# EAGLE schematic logic (EAGLE 9.5.2)
IGVC Motor Control Board
REVISION: v1.2; SCH_DESC: Logic Board; TEAM: IGVC

## Sheet 1 of 5: mBed Breakout
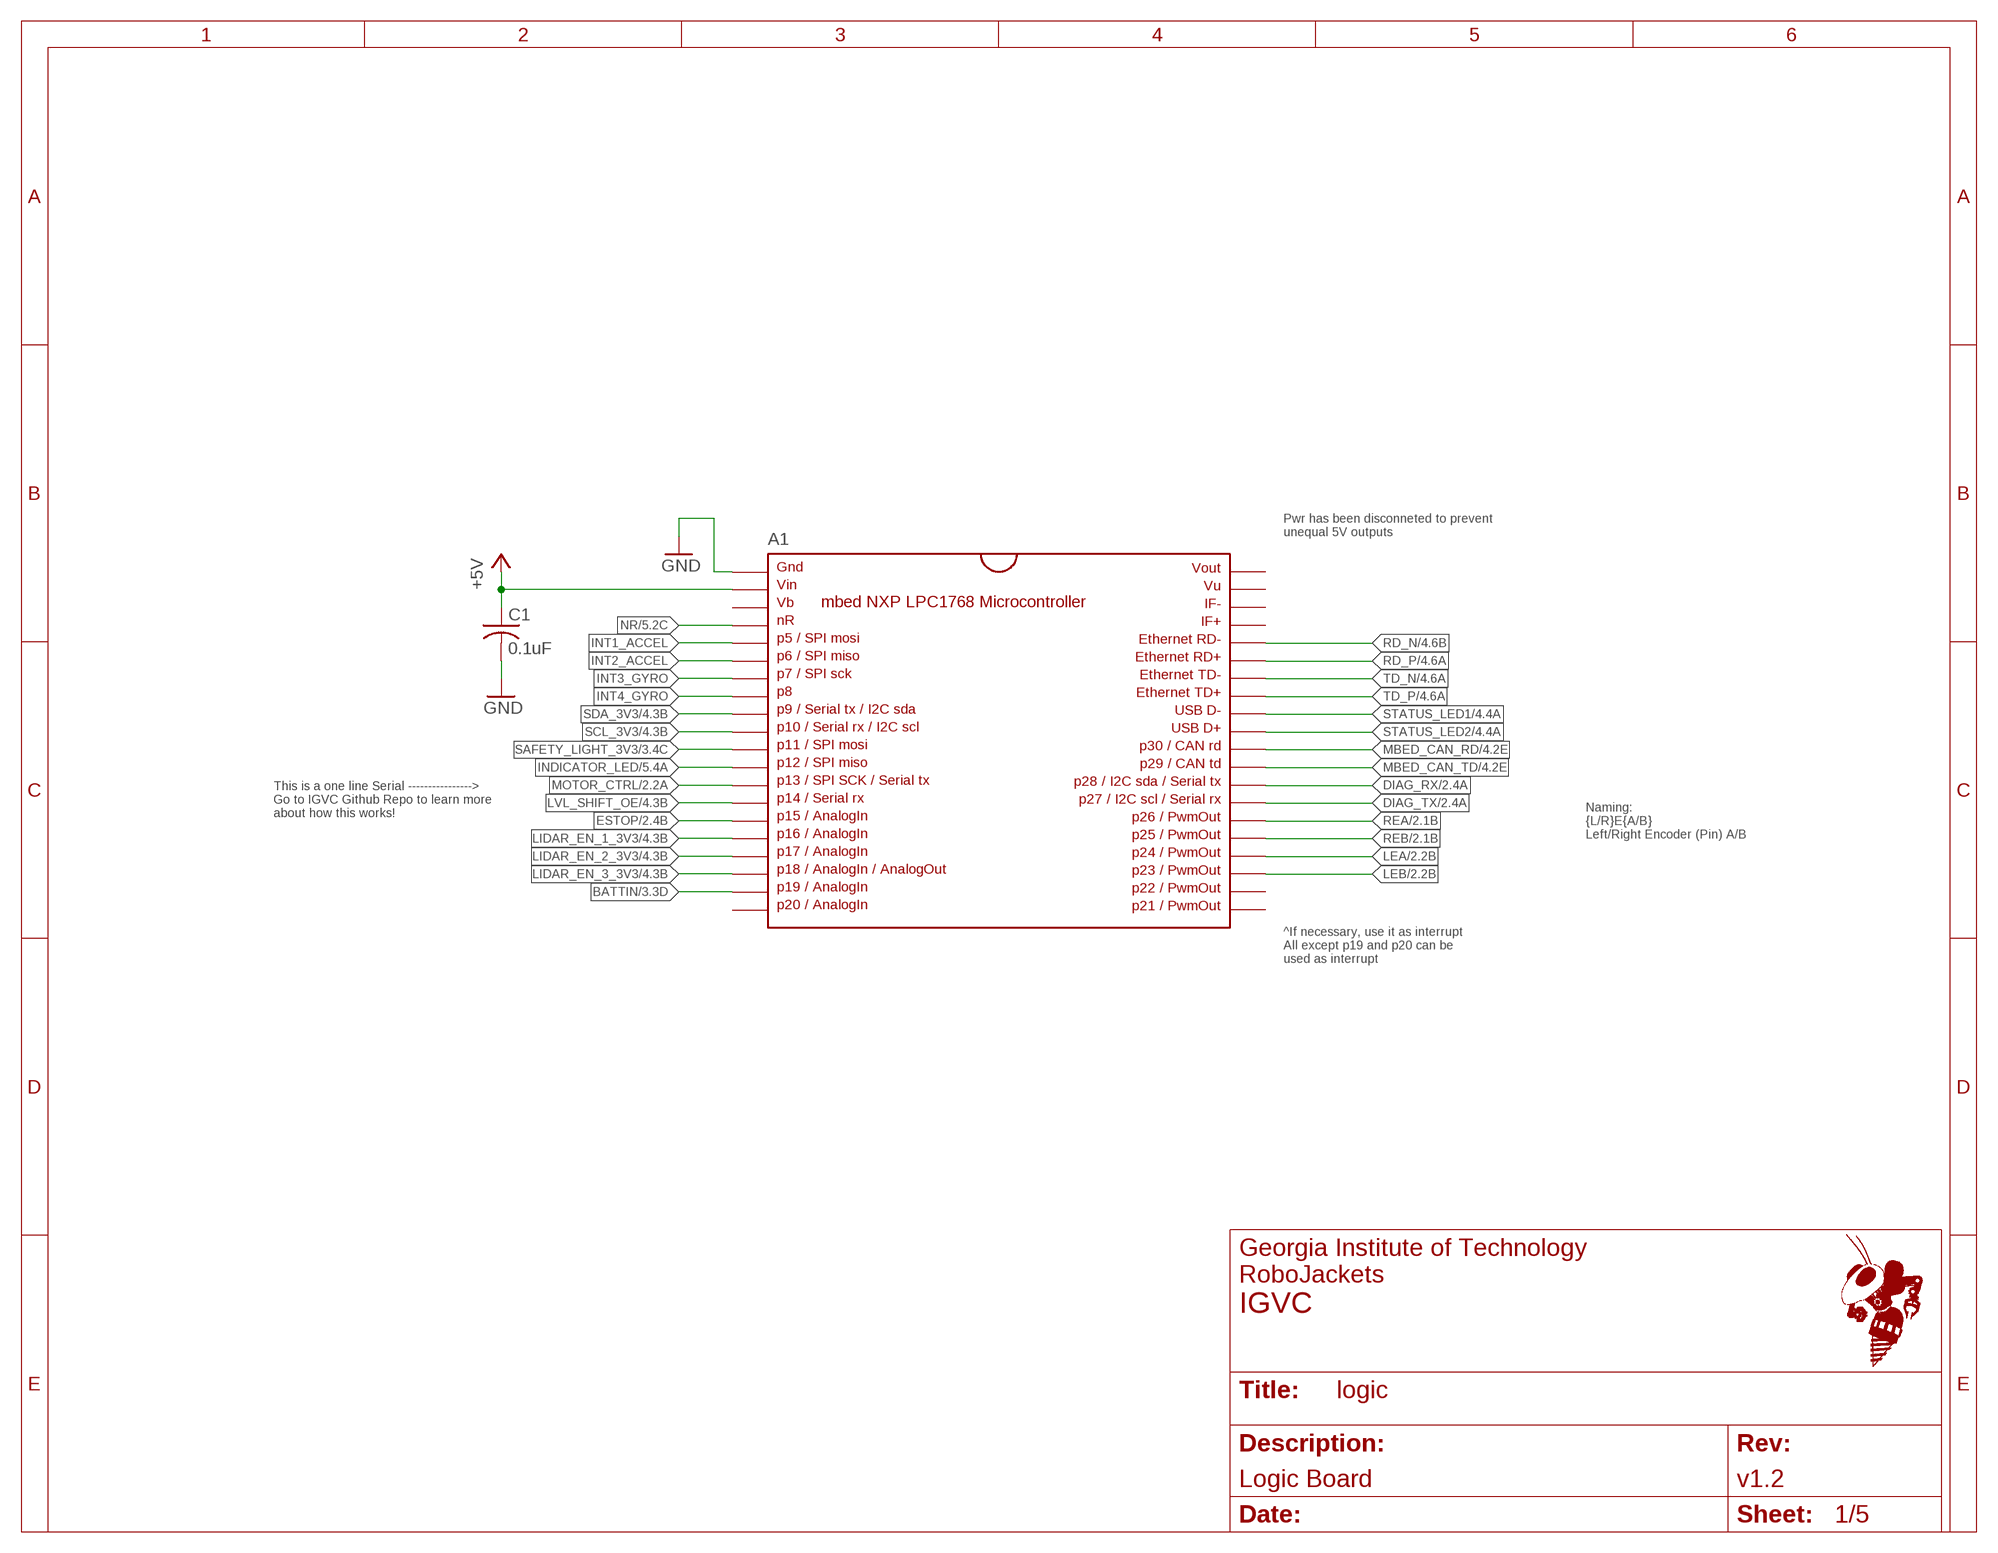
[diagram p0: schematic, sheet 1]

### Parts
A1  MBED1768  SPARKFUN-BOARDS_MBED_NXP_LPC1768  [SPARKFUN-BOARDS_DIL40_0.9]
C1  0.1uF  C-USC0603  [C0603]

### Nets
+5V: A1.2 C1.1 ; also sheet 2,3,4,5
BATTIN: A1.19 ; also sheet 3
DIAG_RX: A1.28 ; also sheet 2
DIAG_TX: A1.27 ; also sheet 2
ESTOP: A1.15 ; also sheet 2
GND: A1.1 C1.2 ; also sheet 2,3,4,5
INDICATOR_LED: A1.12 ; also sheet 5
INT1_ACCEL: A1.5
INT2_ACCEL: A1.6
INT3_GYRO: A1.7
INT4_GYRO: A1.8
LEA: A1.24 ; also sheet 2
LEB: A1.23 ; also sheet 2
LIDAR_EN_1_3V3: A1.16 ; also sheet 4
LIDAR_EN_2_3V3: A1.17 ; also sheet 4
LIDAR_EN_3_3V3: A1.18 ; also sheet 4
LVL_SHIFT_OE: A1.14 ; also sheet 4
MBED_CAN_RD: A1.30 ; also sheet 4
MBED_CAN_TD: A1.29 ; also sheet 4
MOTOR_CTRL: A1.13 ; also sheet 2
NR: A1.4 ; also sheet 5
RD_N: A1.36 ; also sheet 4
RD_P: A1.35 ; also sheet 4
REA: A1.26 ; also sheet 2
REB: A1.25 ; also sheet 2
SAFETY_LIGHT_3V3: A1.11 ; also sheet 3
SCL_3V3: A1.10 ; also sheet 4
SDA_3V3: A1.9 ; also sheet 4
STATUS_LED1: A1.32 ; also sheet 4
STATUS_LED2: A1.31 ; also sheet 4
TD_N: A1.34 ; also sheet 4
TD_P: A1.33 ; also sheet 4
Unconnected: A1.3 A1.20 A1.21 A1.22 A1.37 A1.38 A1.39 A1.40

### Notes on the sheet
- Pwr has been disconneted to prevent
  unequal 5V outputs
- This is a one line Serial ---------------->
  Go to IGVC Github Repo to learn more
  about how this works!
- Naming:
  {L/R}E{A/B}
  Left/Right Encoder (Pin) A/B
- ^If necessary, use it as interrupt
  All except p19 and p20 can be
  used as interrupt

## Sheet 2 of 5: Motor Control
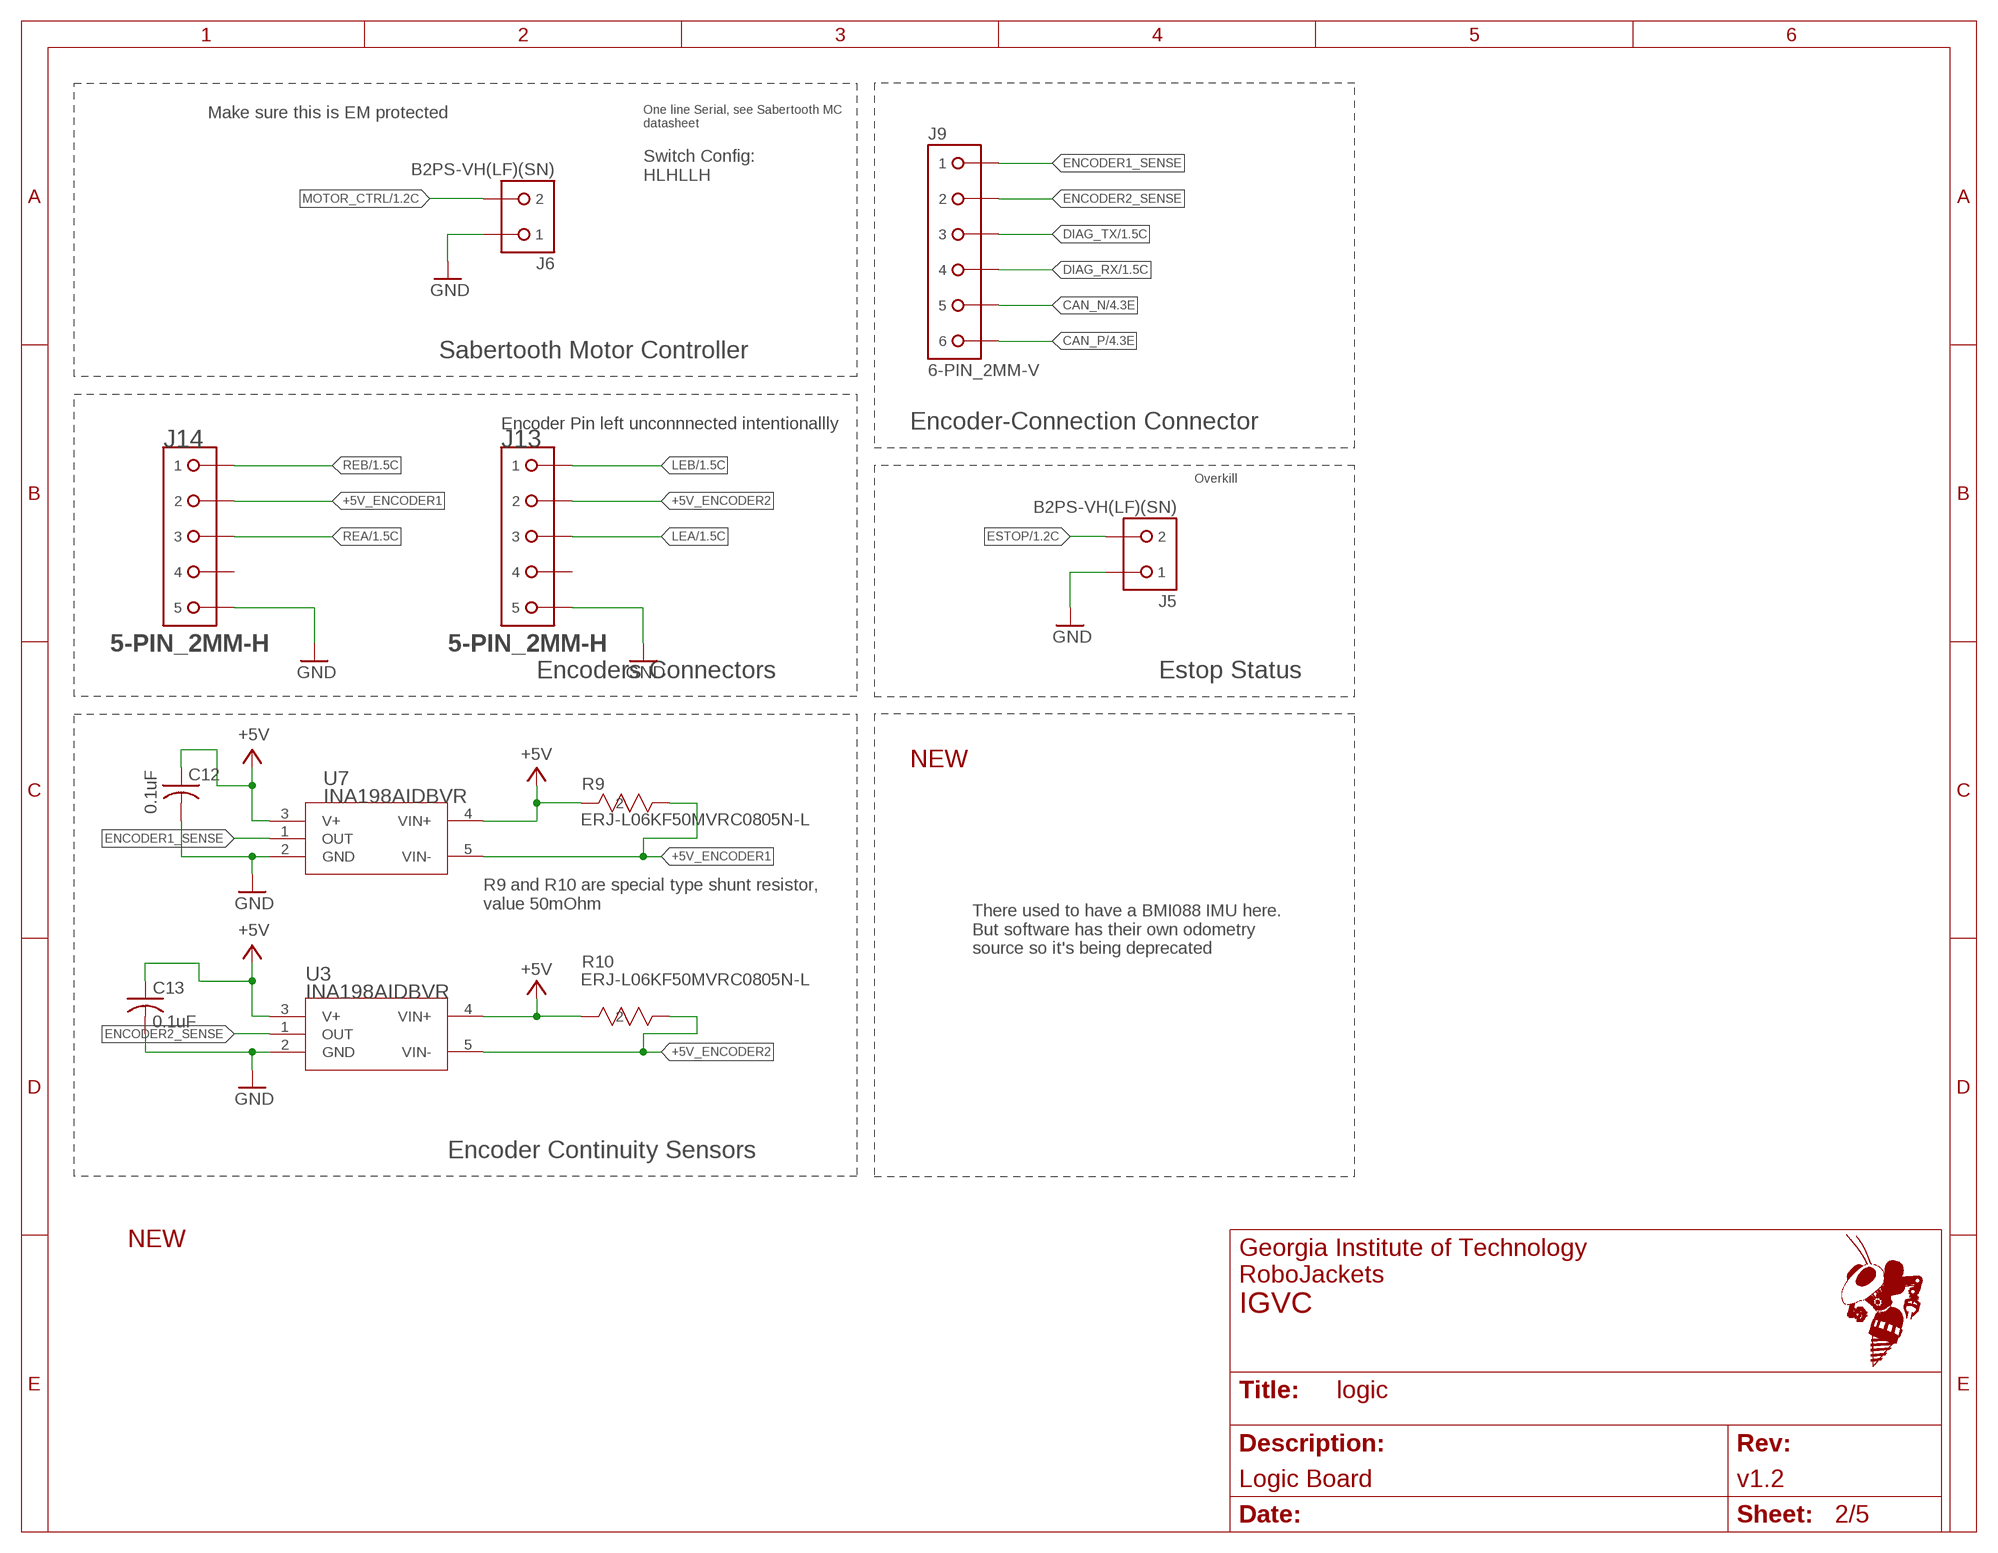
[diagram p1: schematic, sheet 2]

### Parts
C12  0.1uF  C-USC0603  [C0603]
C13  0.1uF  C-USC0603  [C0603]
J5  B2PS-VH(LF)(SN)  [B2PS-CENTERED]
J6  B2PS-VH(LF)(SN)  [B2PS-CENTERED]
J9  6-PIN_2MM-V  [2MM-6-V]
J13  5-PIN_2MM-H  [2MM-5-H]
J14  5-PIN_2MM-H  [2MM-5-H]
R9  ERJ-L06KF50MVRC0805N-L  [RC0805N-L]
R10  ERJ-L06KF50MVRC0805N-L  [RC0805N-L]
U3  INA198AIDBVR  [DBV5]
U7  INA198AIDBVR  [DBV5]

### Nets
+5V: C12.1 C13.1 R9.2 R10.2 U3.3(V+) U3.4(VIN+) U7.3(V+) U7.4(VIN+) ; also sheet 1,3,4,5
+5V_ENCODER1: J14.2 R9.1 U7.5(VIN-)
+5V_ENCODER2: J13.2 R10.1 U3.5(VIN-)
CAN_N: J9.5 ; also sheet 4
CAN_P: J9.6 ; also sheet 4
DIAG_RX: J9.4 ; also sheet 1
DIAG_TX: J9.3 ; also sheet 1
ENCODER1_SENSE: J9.1 U7.1(OUT)
ENCODER2_SENSE: J9.2 U3.1(OUT)
ESTOP: J5.2 ; also sheet 1
GND: C12.2 C13.2 J5.1 J6.1 J13.5 J14.5 U3.2(GND) U7.2(GND) ; also sheet 1,3,4,5
LEA: J13.3 ; also sheet 1
LEB: J13.1 ; also sheet 1
MOTOR_CTRL: J6.2 ; also sheet 1
REA: J14.3 ; also sheet 1
REB: J14.1 ; also sheet 1
Unconnected: J13.4 J14.4

### Notes on the sheet
- Make sure this is EM protected
- One line Serial, see Sabertooth MC 
  datasheet
- Switch Config:
  HLHLLH
- Sabertooth Motor Controller
- Encoder Pin left unconnnected intentionallly | Encoder-Connection Connector
- Overkill
- Encoders Connectors | Estop Status
- NEW
- R9 and R10 are special type shunt resistor,
  value 50mOhm
- There used to have a BMI088 IMU here. 
  But software has their own odometry
  source so it's being deprecated
- Encoder Continuity Sensors
- NEW

## Sheet 3 of 5: Light Control
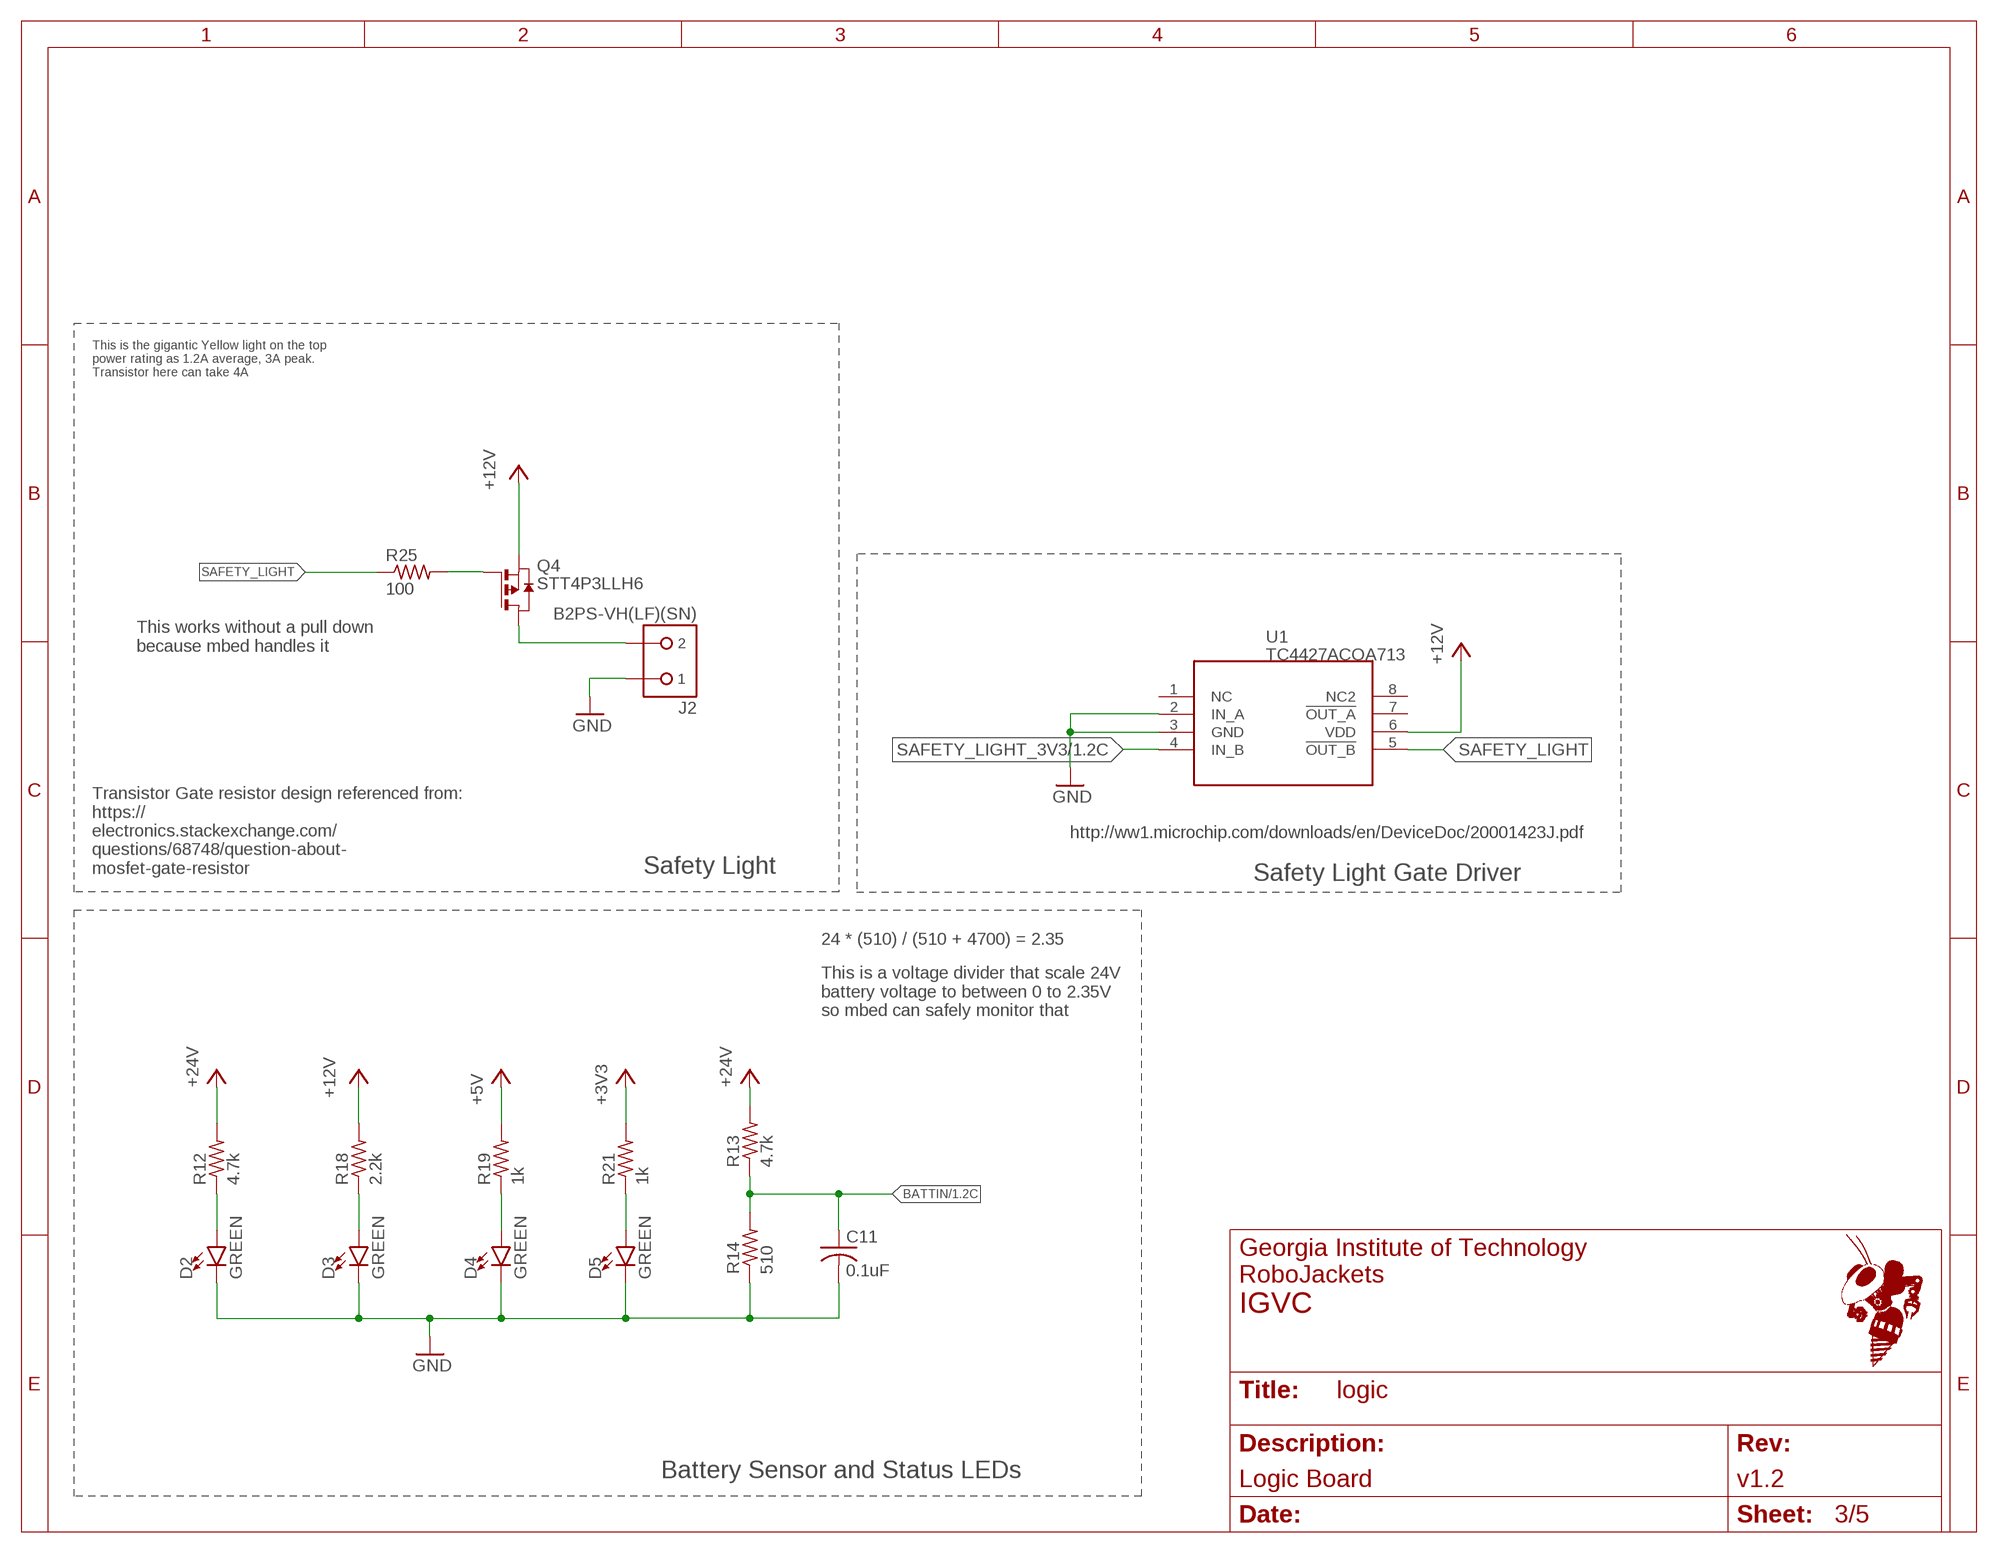
[diagram p2: schematic, sheet 3]

### Parts
C11  0.1uF  C-USC0603  [C0603]
D2  GREEN  LED-BLUE0603  [LED-0603]
D3  GREEN  LED-BLUE0603  [LED-0603]
D4  GREEN  LED-GREEN0603  [LED-0603]
D5  GREEN  LED-GREEN0603  [LED-0603]
J2  B2PS-VH(LF)(SN)  [B2PS-CENTERED]
Q4  STT4P3LLH6  [SOT23-6]
R12  4.7k  R-US_R0603  [R0603]
R13  4.7k  R-US_R0603  [R0603]
R14  510  R-US_R0603  [R0603]
R18  2.2k  R-US_R0603  [R0603]
R19  1k  R-US_R0603  [R0603]
R21  1k  R-US_R0603  [R0603]
R25  100  R-US_R0603  [R0603]
U1  TC4427ACOA713  [SOIC-8]

### Nets
3V3_LED_R: D5.A R21.1
5V_LED_R: D4.A R19.1
12V_LED_R: D3.A R18.1
+3V3: R21.2 ; also sheet 4,5
+5V: R19.2 ; also sheet 1,2,4,5
+12V: Q4.4(S) R18.2 U1.6(VDD) ; also sheet 5
+24V: R12.2 R13.2 ; also sheet 5
BATTIN: C11.1 R13.1 R14.2 ; also sheet 1
GND: C11.2 D2.C D3.C D4.C D5.C J2.1 R14.1 U1.2(IN_A) U1.3(GND) ; also sheet 1,2,4,5
N$1: D2.A R12.1
SAFETY_HRD: J2.2 Q4.1(D) Q4.2(D) Q4.5(D) Q4.6(D)
SAFETY_LIGHT: R25.1 U1.5(!OUT_B)
SAFETY_LIGHT_3V3: U1.4(IN_B) ; also sheet 1
SAFETY_R: Q4.3(G) R25.2
Unconnected: U1.1(NC) U1.7(!OUT_A) U1.8(NC2)

### Notes on the sheet
- This is the gigantic Yellow light on the top
  power rating as 1.2A average, 3A peak.
  Transistor here can take 4A
- This works without a pull down
  because mbed handles it
- http://ww1.microchip.com/downloads/en/DeviceDoc/20001423J.pdf
- Transistor Gate resistor design referenced from:
  https://
  electronics.stackexchange.com/
  questions/68748/question-about-
  mosfet-gate-resistor
- Safety Light
- Safety Light Gate Driver
- 24 * (510) / (510 + 4700) = 2.35
- This is a voltage divider that scale 24V
  battery voltage to between 0 to 2.35V
  so mbed can safely monitor that
- Battery Sensor and Status LEDs

## Sheet 4 of 5: Sensor and Comm
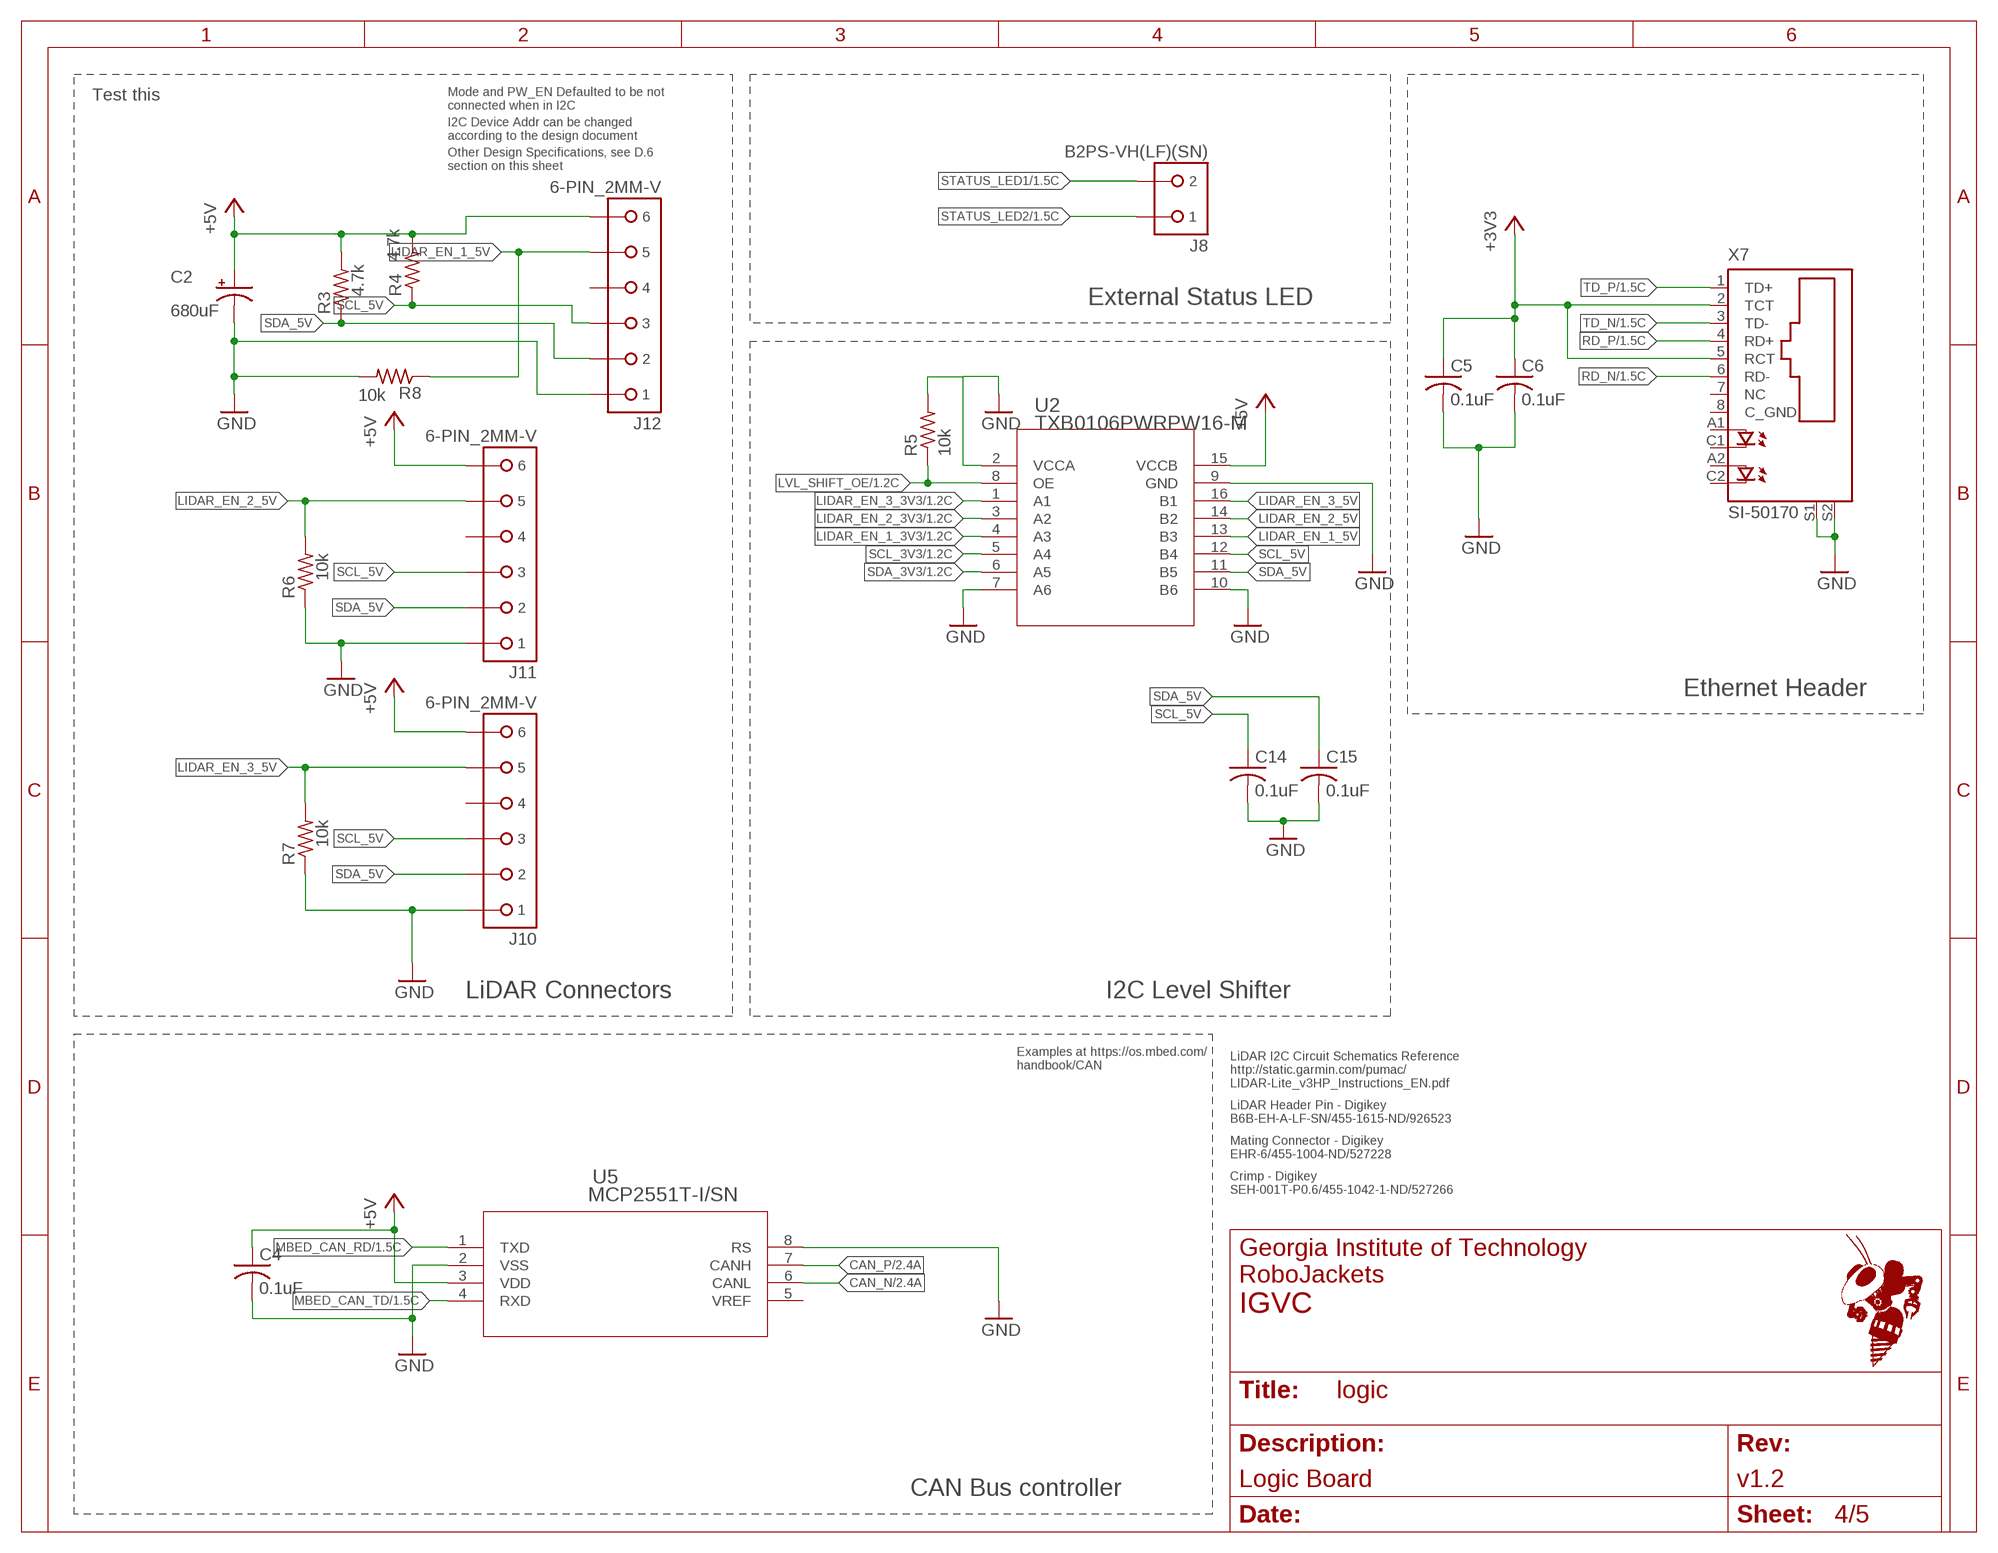
[diagram p3: schematic, sheet 4]

### Parts
C2  680uF  CPOL-USE5-5  [E5-5]
C4  0.1uF  C-USC0603  [C0603]
C5  0.1uF  C-USC0603  [C0603]
C6  0.1uF  C-USC0603  [C0603]
C14  0.1uF  C-USC0603  [C0603]
C15  0.1uF  C-USC0603  [C0603]
J8  B2PS-VH(LF)(SN)  [B2PS-CENTERED]
J10  6-PIN_2MM-V  [2MM-6-V]
J11  6-PIN_2MM-V  [2MM-6-V]
J12  6-PIN_2MM-V  [2MM-6-V]
R3  4.7k  R-US_R0603  [R0603]
R4  4.7k  R-US_R0603  [R0603]
R5  10k  R-US_R0603  [R0603]
R6  10k  R-US_R0603  [R0603]
R7  10k  R-US_R0603  [R0603]
R8  10k  R-US_R0603  [R0603]
U2  TXB0106PWRPW16-M  [PW16-M]
U5  MCP2551T-I/SN  [SOIC8-N_MC]
X7  SI-50170  [SI-50170]

### Nets
+3V3: C5.1 C6.1 X7.2(TCT) X7.5(RCT) ; also sheet 3,5
+5V: C2.+ C4.1 J10.6 J11.6 J12.6 R3.2 R4.2 U2.15(VCCB) U5.3(VDD) ; also sheet 1,2,3,5
CAN_N: U5.6(CANL) ; also sheet 2
CAN_P: U5.7(CANH) ; also sheet 2
GND: C2.- C4.2 C5.2 C6.2 C14.2 C15.2 J10.1 J11.1 J12.1 R5.2 R6.1 R7.1 R8.2 U2.2(VCCA) U2.7(A6) U2.9(GND) U2.10(B6) U5.2(VSS) U5.8(RS) X7.S1 X7.S2 ; also sheet 1,2,3,5
LIDAR_EN_1_3V3: U2.4(A3) ; also sheet 1
LIDAR_EN_1_5V: J12.5 R8.1 U2.13(B3)
LIDAR_EN_2_3V3: U2.3(A2) ; also sheet 1
LIDAR_EN_2_5V: J11.5 R6.2 U2.14(B2)
LIDAR_EN_3_3V3: U2.1(A1) ; also sheet 1
LIDAR_EN_3_5V: J10.5 R7.2 U2.16(B1)
LVL_SHIFT_OE: R5.1 U2.8(OE) ; also sheet 1
MBED_CAN_RD: U5.1(TXD) ; also sheet 1
MBED_CAN_TD: U5.4(RXD) ; also sheet 1
RD_N: X7.6(RD-) ; also sheet 1
RD_P: X7.4(RD+) ; also sheet 1
SCL_3V3: U2.5(A4) ; also sheet 1
SCL_5V: C14.1 J10.3 J11.3 J12.3 R4.1 U2.12(B4)
SDA_3V3: U2.6(A5) ; also sheet 1
SDA_5V: C15.1 J10.2 J11.2 J12.2 R3.1 U2.11(B5)
STATUS_LED1: J8.2 ; also sheet 1
STATUS_LED2: J8.1 ; also sheet 1
TD_N: X7.3(TD-) ; also sheet 1
TD_P: X7.1(TD+) ; also sheet 1
Unconnected: J10.4 J11.4 J12.4 U5.5(VREF) X7.7(NC) X7.8(C_GND) X7.A1(A) X7.A2(A1) X7.C1(C) X7.C2(C1)

### Notes on the sheet
- Test this
- Mode and PW_EN Defaulted to be not
  connected when in I2C
- I2C Device Addr can be changed
  according to the design document
- Other Design Specifications, see D.6
  section on this sheet
- External Status LED
- Ethernet Header
- LiDAR Connectors | I2C Level Shifter
- Examples at https://os.mbed.com/
  handbook/CAN
- LiDAR I2C Circuit Schematics Reference
  http://static.garmin.com/pumac/
  LIDAR-Lite_v3HP_Instructions_EN.pdf
- LiDAR Header Pin - Digikey
  B6B-EH-A-LF-SN/455-1615-ND/926523
- Mating Connector - Digikey
  EHR-6/455-1004-ND/527228
- Crimp - Digikey
  SEH-001T-P0.6/455-1042-1-ND/527266
- CAN Bus controller

## Sheet 5 of 5: Misc.
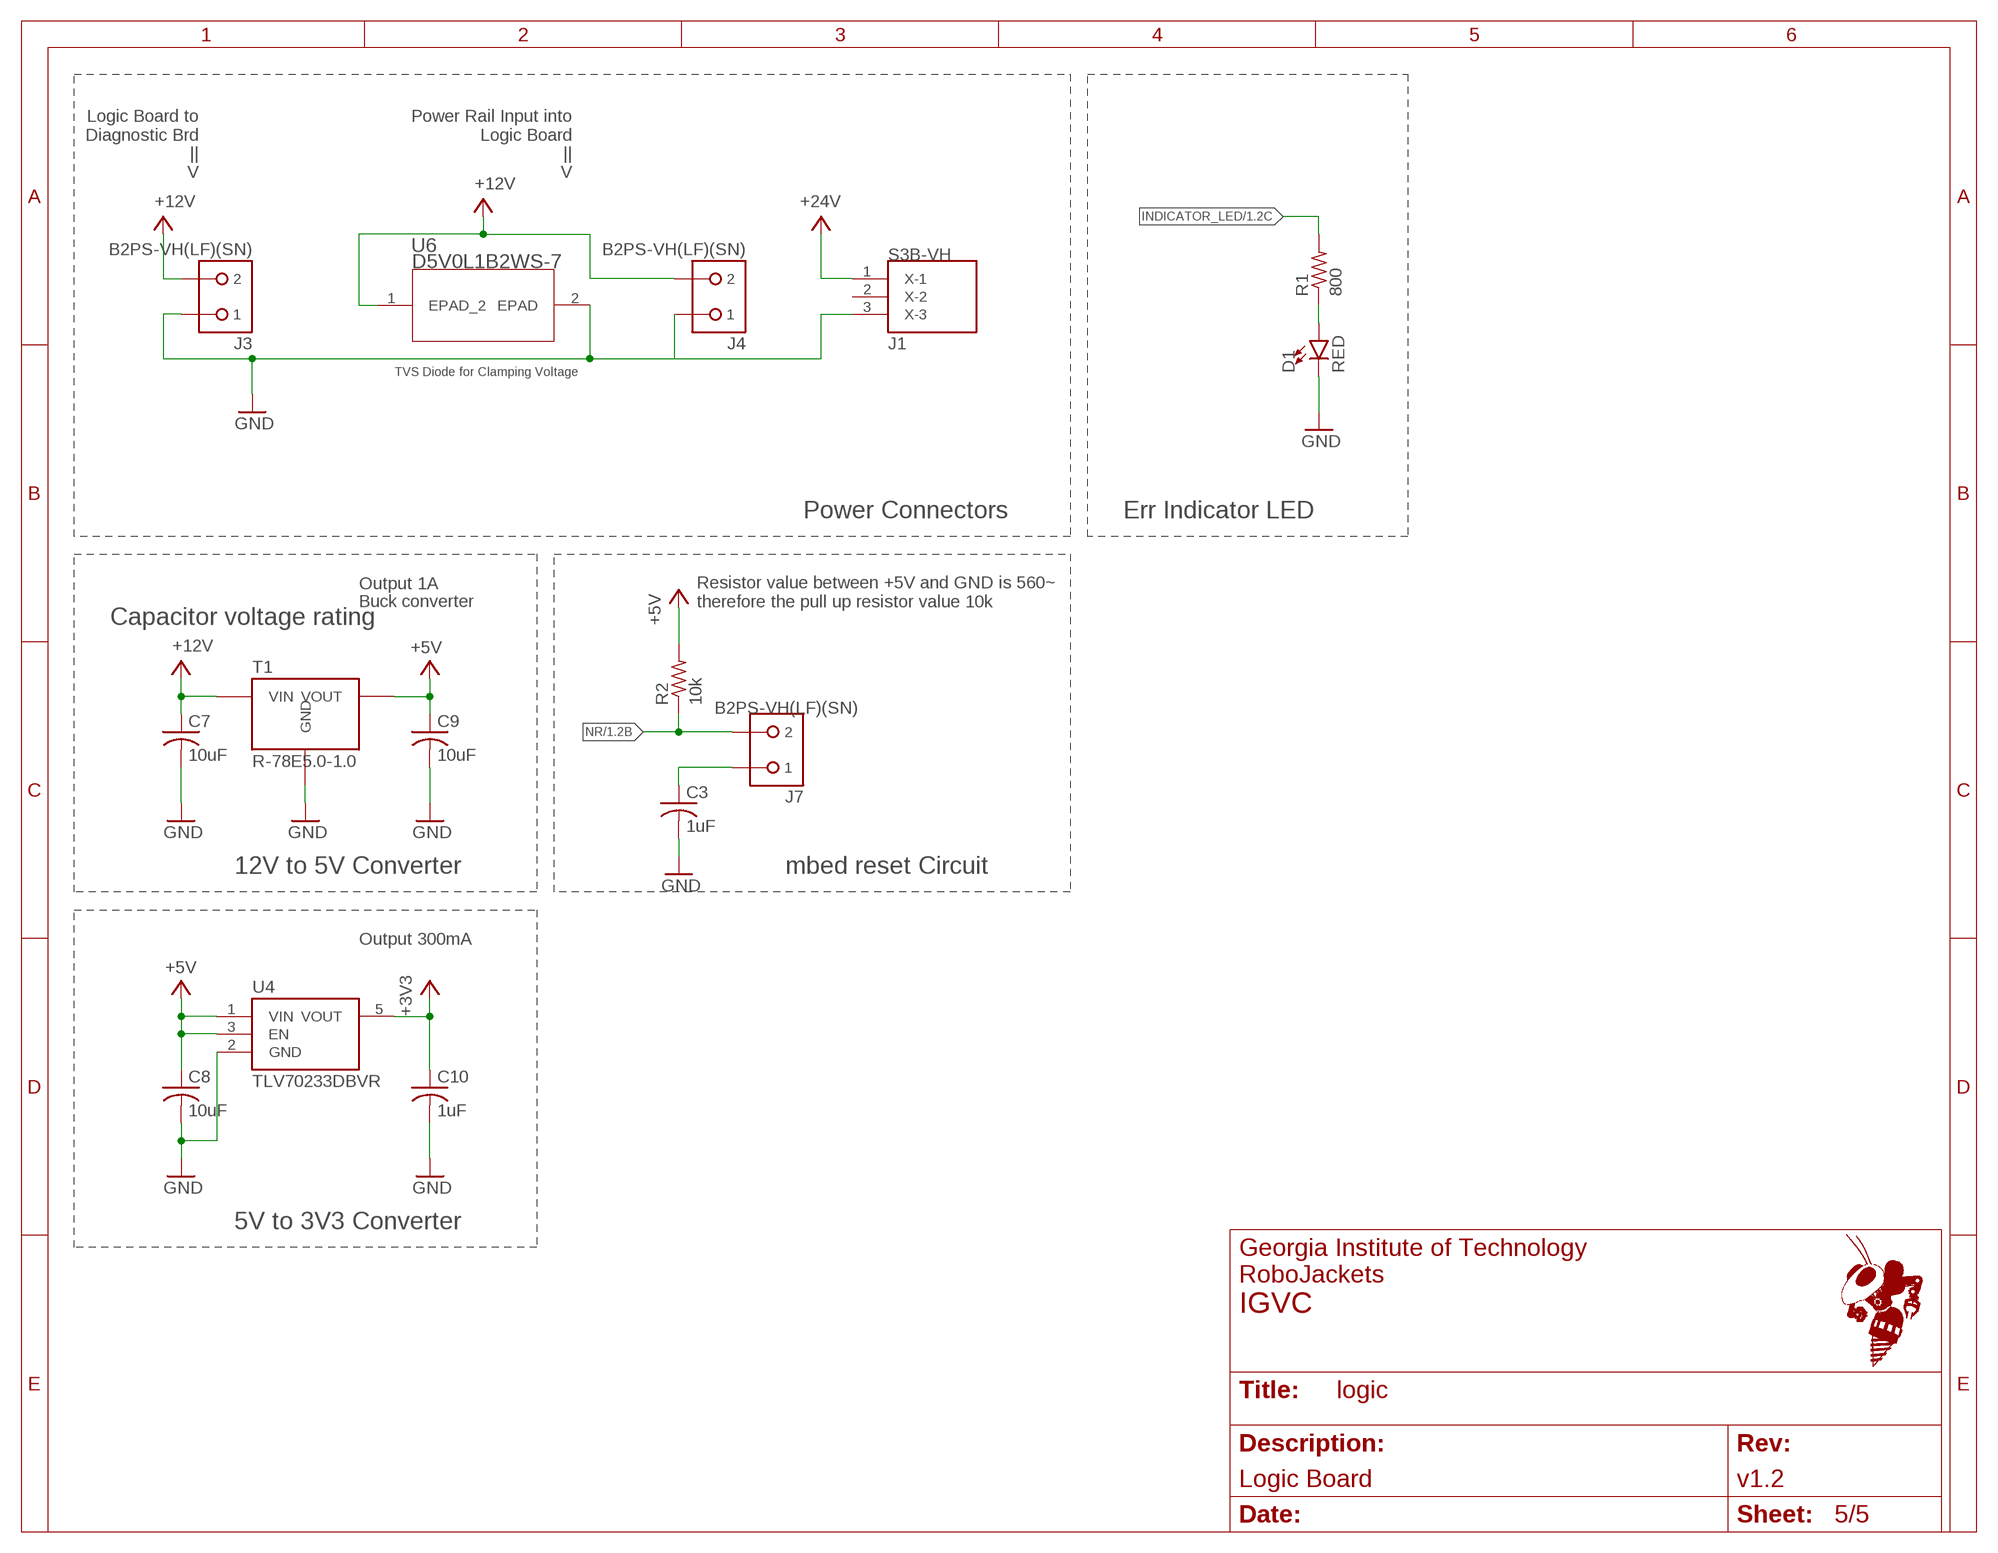
[diagram p4: schematic, sheet 5]

### Parts
C3  1uF  C-USC0805  [C0805]
C7  10uF  C-USC0805  [C0805]
C8  10uF  C-USC0805  [C0805]
C9  10uF  C-USC0805  [C0805]
C10  1uF  C-USC0805  [C0805]
D1  RED  LED-BLUE0603  [LED-0603]
J1  S3B-VH  [S3B-VH]
J3  B2PS-VH(LF)(SN)  [B2PS-CENTERED]
J4  B2PS-VH(LF)(SN)  [B2PS-CENTERED]
J7  B2PS-VH(LF)(SN)  [B2PS-CENTERED]
R1  800  R-US_R0603  [R0603]
R2  10k  R-US_R0603  [R0603]
T1  R-78E5.0-1.0  [R-78E]
U4  TLV70233DBVR  [SOT-23-5]
U6  D5V0L1B2WS-7  [SOD323]

### Nets
+3V3: C10.1 U4.5(VOUT) ; also sheet 3,4
+5V: C8.1 C9.1 R2.2 T1.3(VOUT) U4.1(VIN) U4.3(EN) ; also sheet 1,2,3,4
+12V: C7.1 J3.2 J4.2 T1.1(VIN) U6.1(EPAD_2) ; also sheet 3
+24V: J1.1(X-1) ; also sheet 3
GND: C3.2 C7.2 C8.2 C9.2 C10.2 D1.C J1.3(X-3) J3.1 J4.1 T1.2(GND) U4.2(GND) U6.2(EPAD) ; also sheet 1,2,3,4
INDICATOR_LED: R1.2 ; also sheet 1
N$2: D1.A R1.1
N$3: C3.1 J7.1
NR: J7.2 R2.1 ; also sheet 1
Unconnected: J1.2(X-2)

### Notes on the sheet
- Logic Board to
  Diagnostic Brd
               ||
               V
- Power Rail Input into
  Logic Board
               ||
               V
- TVS Diode for Clamping Voltage
- Power Connectors | Err Indicator LED
- Output 1A
- Buck converter
- Resistor value between +5V and GND is 560~
  therefore the pull up resistor value 10k
- Capacitor voltage rating
- 12V to 5V Converter | mbed reset Circuit
- Output 300mA
- 5V to 3V3 Converter

## Library data of the parts
A1 = MotorBoardDev:SPARKFUN-BOARDS_MBED_NXP_LPC1768: mbed LPC1768 board footprint Boards using this footprint: mbed - LPC1768 (Cortex-M3) (DEV-09564); PROD_ID: COMP-12167
C1 C3-C15 = rcl:C-US: CAPACITOR, American symbol; SPICEPREFIX: C
C2 = rcl:CPOL-US: POLARIZED CAPACITOR, American symbol; SPICEPREFIX: C
D1-D3 = SparkFun-LED:LED-BLUE: Blue SMD LED Used in manufacturing of various products at SparkFun Packages: 0603 - SMD 0603 package [Product Link] <http://www.digikey.com/product-detail/en/SMLE12BC7TT86/511-1589-2-ND/1641808> 1206 - SMD1206 package [Product Link] <http://www.digikey.com/product-detail/en/lite-on-inc/LTST-C150TBKT/160-1643-1-ND/573584> SparkFun Products: ESP8266 Thing-Dev Board <https://www.sparkfun.com/products/13711> RedBoard <https://www.sparkfun.com/products/12757>; PROD_ID: DIO-08575; VALUE: BLUE
D4 D5 = SparkFun-LED:LED-GREEN: Green SMD LED Used in manufacturing of various products at SparkFun Packages: 0603 - SMD 0603 package [Product Link] <http://www.futureelectronics.com/en/technologies/semiconductors/optoelectronics/leds/Pages/9894312-LTST-C190GKT.aspx?CrossPart=HSMG-C190&IM=0> LilyPad 1206 - SMD1206 LilyPad package [Product Link] <http://www.futureelectronics.com/en/Technologies/Product.aspx?ProductID=IN150NGHARVATEKCORPORATION2049943&IM=0> 1206 - SMD1206 package [Product Link] <http://www.futureelectronics.com/en/technologies/semiconductors/optoelectronics/leds/Pages/8315665-LTST-C150KGKT.aspx?IM=0> 1206 Bottom Mount -SMD 1206 Bottom Mount [Product Link] <http://www.digikey.com/product-detail/en/lite-on-inc/LTST-C230KGKT/160-1456-1-ND/386854> SparkFun Products: Pro Mini 328 -5V <https://www.sparkfun.com/products/821> RedBoard <https://www.sparkfun.com/products/12757> MP3 Trigger <https://www.sparkfun.com/products/13720> Makey Makey <https://www.sparkfun.com/products/11076>; PROD_ID: DIO-00821
J1 = IGVC-Connector:S3B-VH
J2-J8 = RoboJackets-Connectors:B2P?-VH(LF)(SN): Power Connector Brand: JST Sales America Inc. <https://www.jst.com/> Series: VH <http://www.digikey.com/product-search/en?FV=fff40016,fff802f3,ffec0e9d> Distributor: Digi-Key <http://www.digikey.com/product-detail/en/B2PS-VH%28LF%29%28SN%29/455-1648-ND/926555>; DIGIKEY: 455-1648-ND; MPN: B2PS-VH(LF)(SN)
J9-J12 = RoboJackets-Connectors:6-PIN_2MM-*; PINS: 6; PIN_PITCH: 2.0 mm
J13 J14 = RoboJackets-Connectors:5-PIN_2MM-*; PINS: 5; PIN_PITCH: 2.0 mm
Q4 = MotorBoardDev:STT4P3LLH6
R1-R8 R12-R14 R18 R19 R21 R25 = rcl:R-US_: RESISTOR, American symbol; SPICEPREFIX: R
R9 R10 = IGVC-Discrete:ERJ-L06KF50MV; MANUFACTURER_PART_NUMBER: ERJL06KF50MV; VENDOR: Panasonic
T1 = MotorBoardDev:R-78E5.0-1.0
U1 = MotorBoardDev:TC4427ACOA713
U2 = IGVC-IC:TXB0106PWR; MANUFACTURER_PART_NUMBER: TXB0106PWR; VENDOR: Texas Instruments
U3 U7 = IGVC-Sensor:INA198AIDBVR; MANUFACTURER_PART_NUMBER: INA198AIDBVR; VENDOR: Texas Instruments
U4 = RoboJackets-PowerICs:TLV70233; DIGIKEY: 296-32415-1-ND; MPN: TLV70233DBVR
U5 = IGVC-Microcontroller:MCP2551T-I/SN; MANUFACTURER_PART_NUMBER: MCP2551TISN; VENDOR: Microchip
U6 = IGVC-Discrete:D5V0L1B2WS-7; BUILT_BY: EMA_UL_Team; MANUFACTURER_PART_NUMBER: D5V0L1B2WS-7; VENDOR: Diodes Inc
X7 = con-stewart:SI-50170: Ethernet Connector MagJack (R) Source: www.stewartconnector.com .. si-50170.pdf; OC_FARNELL: unknown; OC_NEWARK: unknown